# Altium schematic sheet 模拟触发器2.SchDoc
size A4
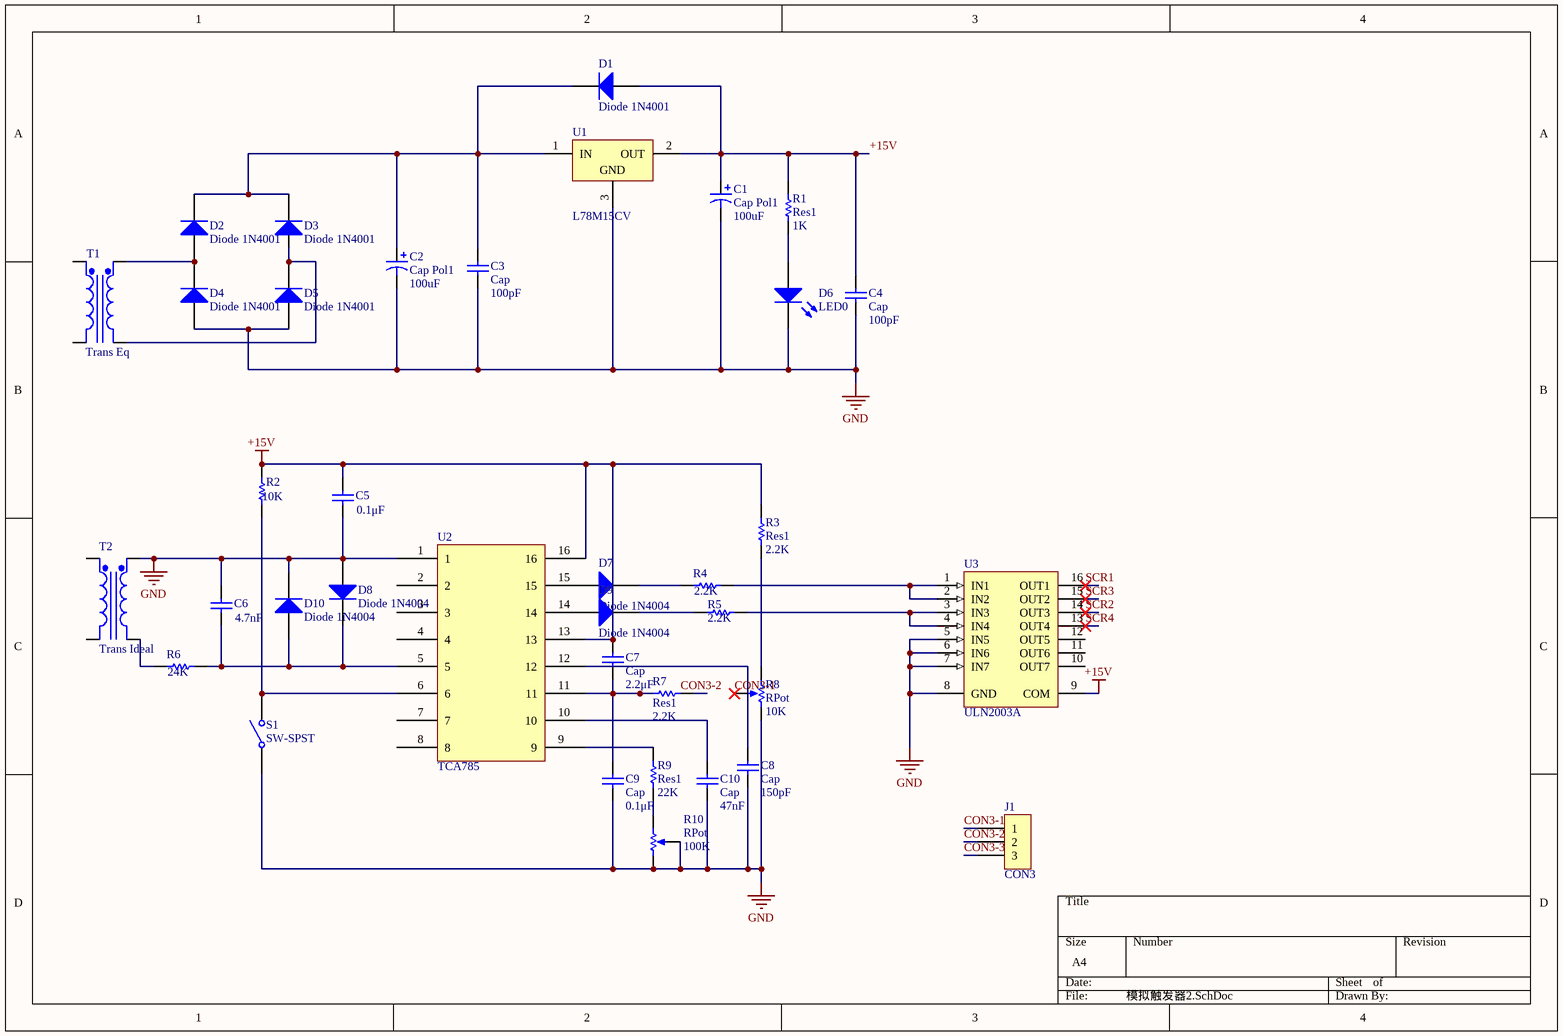
[diagram p0: 模拟触发器2.SchDoc]

## Parts
C1  Cap Pol1  value 100uF  [RB7.6-15]
C2  Cap Pol1  value 100uF  [RB7.6-15]
C3  Cap  value 100pF  [6-0805]
C4  Cap  value 100pF  [6-0805]
C5  value 0.1μF  [6-0805]  (hidden comment: Cap)
C6  value 4.7nF  [6-0805]  (hidden comment: Cap)
C7  Cap  value 2.2μF  [6-0805]
C8  Cap  value 150pF  [6-0805]
C9  Cap  value 0.1μF  [6-0805]
C10  Cap  value 47nF  [6-0805]
D1  Diode 1N4001  [DO-41]
D2  Diode 1N4001  [DO-41]
D3  Diode 1N4001  [DO-41]
D4  Diode 1N4001  [DO-41]
D5  Diode 1N4001  [DO-41]
D6  LED0  [6-0805]
D7  Diode 1N4004  [DO-41]
D8  Diode 1N4004  [DO-41]
D9  Diode 1N4004  [DO-41]
D10  Diode 1N4004  [DO-41]
J1  CON3  [DG1283-5.0]
R1  Res1  value 1K  [6-0805]
R2  value 10K  [6-0805]  (hidden comment: Res1)
R3  Res1  value 2.2K  [6-0805]
R4  value 2.2K  [6-0805]  (hidden comment: Res1)
R5  value 2.2K  [6-0805]  (hidden comment: Res1)
R6  value 24K  [1206]  (hidden comment: Res1)
R7  Res1  value 2.2K  [6-0805]
R8  RPot  value 10K  [VR5]
R9  Res1  value 22K  [6-0805]
R10  RPot  value 100K  [VR5]
S1  SW-SPST  [SPST-2]
T1  Trans Eq  [TRF_4]
T2  Trans Ideal  [TRF_4]
U1  L78M15CV  [TO220V]
U2  TCA785  [DIP-16]
U3  ULN2003A  [A16]

## Nets
+15V: C1.1 C4.2 C5.2 C7.2 D1.1(A) R1.2 R2.2 R3.2 U1.2(OUT) U2.13 U2.16 U3.9(COM)
GND: C1.2 C2.2 C3.1 C4.1 C5.1 C6.2 C8.1 C9.1 C10.1 D4.1(A) D5.1(A) D6.2(K) D8.1(A) D10.2(K) R8.2(BOT) R10.1(TOP) R10.3(TAP) S1.1(COMMON) T2.3(Sec+) U1.3(GND) U2.1 U3.5(IN5) U3.6(IN6) U3.7(IN7) U3.8(GND)
CON3-1: J1.1 R8.3(TAP)
CON3-2: J1.2
CON3-3: J1.3
SCR1: U3.16(OUT1)
SCR2: U3.14(OUT3)
SCR3: U3.15(OUT2)
SCR4: U3.13(OUT4)
NetC2_1: C2.1 C3.2 D1.2(K) D2.2(K) D3.2(K) U1.1(IN)
NetC6_1: C6.1 D8.2(K) D10.1(A) R6.1 U2.5
NetC7_1: C7.1 C9.2 R7.2 U2.11
NetC8_2: C8.2 U2.12
NetC10_2: C10.2 U2.10
NetD2_1: D2.1(A) D4.2(K) T1.3(Sec+)
NetD3_1: D3.1(A) D5.2(K) T1.4(Sec-)
NetD6_1: D6.1(A) R1.1
NetD7_2: D7.2(K) R4.2
NetD9_2: D9.2(K) R5.2
NetR2_1: R2.1 S1.2(NO) U2.6
NetR3_1: R3.1 R8.1(TOP)
NetR4_1: R4.1 U3.1(IN1) U3.2(IN2)
NetR5_1: R5.1 U3.3(IN3) U3.4(IN4)
NetR6_2: R6.2 T2.4(Sec-)
NetR9_1: R9.1 R10.2(BOT)
NetR9_2: R9.2 U2.9

Not connected (* = marked no-connect by the designer): D7 1(A); D9 1(A); R7 1; T1 1(Pri+) 2(Pri-); T2 1(Pri+) 2(Pri-); U2 2 3 4 7 8 14 15; U3 10(OUT7) 11(OUT6) 12(OUT5)

## Notes on the sheet
- Labels drawn without touching a wire or pin: CON3-2

## Library data of the parts
C1 C2 = Cap Pol1: Polarized Capacitor (Radial); Published: 8-Jun-2000; LatestRevisionDate: 17-Jul-2002; LatestRevisionNote: Re-released for DXP Platform.; PackageReference: RB7.6-15; Publisher: Altium Limited
C3-C10 = Cap: Capacitor; Published: 8-Jun-2000; LatestRevisionDate: 17-Jul-2002; LatestRevisionNote: Re-released for DXP Platform.; PackageReference: RAD-0.3; Publisher: Altium Limited
D1-D5 = Diode 1N4001: 1 Amp General Purpose Rectifier; Published: 8-Jun-2000; LatestRevisionDate: 17-Jul-2002; LatestRevisionNote: Re-released for DXP Platform.; DatasheetDocument: 1998; PackageDocument: Aug-1999; PackageReference: DO-41; Publisher: Altium Limited; Code_JEDEC: DO-204-AL; ComponentLink1Description: Manufacturer Link; ComponentLink1URL: http://www.fairchildsemi.com/; ComponentLink2Description: Datasheet; ComponentLink2URL: http://www.fairchildsemi.com/ds/1N%2F1N4001.pdf
D6 = LED0: Typical INFRARED GaAs LED; Published: 8-Jun-2000; LatestRevisionDate: 08-Jul-2005; LatestRevisionNote: Mech Layer 1 removed.; PackageReference: LED-0; Publisher: Altium Limited
D7-D10 = Diode 1N4004: 1 Amp General Purpose Rectifier; Published: 8-Jun-2000; LatestRevisionDate: 17-Jul-2002; LatestRevisionNote: Re-released for DXP Platform.; DatasheetDocument: 1998; PackageDocument: Aug-1999; PackageReference: DO-41; Publisher: Altium Limited; Code_JEDEC: DO-204-AL; ComponentLink1Description: Manufacturer Link; ComponentLink1URL: http://www.fairchildsemi.com/; ComponentLink2Description: Datasheet; ComponentLink2URL: http://www.fairchildsemi.com/ds/1N%2F1N4001.pdf
R1-R7 R9 = Res1: Resistor; Published: 8-Jun-2000; LatestRevisionDate: 17-Jul-2002; LatestRevisionNote: Re-released for DXP Platform.; PackageReference: AXIAL-0.3; Publisher: Altium Limited
R8 R10 = RPot: Potentiometer; Sim Note: Enter the Resistance value and the set point into parameter fields.; Set Position: 0.5; Published: 8-Jun-2000; LatestRevisionDate: 17-Jul-2002; LatestRevisionNote: Re-released for DXP Platform.; PackageReference: VR5; Publisher: Altium Limited
S1 = SW-SPST: Single-Pole, Single-Throw Switch; Published: 24-Mar-1999; LatestRevisionDate: 17-Jul-2002; LatestRevisionNote: Re-released for DXP Platform.; PackageReference: SPST-2; Publisher: Altium Limited
T1 = Trans Eq: Transformer (Equivalent Circuit Model); Published: 8-Jun-2000; LatestRevisionDate: 17-Jul-2002; LatestRevisionNote: Re-released for DXP Platform.; PackageReference: TRF_4; Publisher: Altium Limited
T2 = Trans Ideal: Transformer (Ideal); Published: 8-Jun-2000; LatestRevisionDate: 17-Jul-2002; LatestRevisionNote: Re-released for DXP Platform.; PackageReference: TRF_4; Publisher: Altium Limited
U1 = L78M15CV: Positive Voltage Regulator; Note: Tab is connected to pin 3 (GND).; Published: 24-Aug-2001; LatestRevisionDate: 17-Jul-2002; LatestRevisionNote: Re-released for DXP Platform.; DatasheetVersion: Apr-1994; PackageReference: TO220V; Publisher: Altium Limited; PackageDescription: TO, Thru-Hole, Vertical, Heatsink Mounted; 3 In-Line Leads; Pitch 2.54 mm; Pin sequence 1, 3, 2; ComponentLink1Description: Manufacturer Link; ComponentLink1URL: http://www.st.com/; ComponentLink2Description: Datasheet; ComponentLink2URL: http://www.st.com/stonline/products/literature/ds/2146/l78m05c.pdf
U3 = ULN2003A: High-Voltage, High-Current Darlington Array; Published: 13-Oct-2000; LatestRevisionDate: 06-Jun-2005; LatestRevisionNote: Stylized 3D Model Added.; DatasheetVersion: 1998; PackageVersion: 1998; PackageReference: A16; Publisher: Altium Limited; PackageDescription: DIP; 16 Leads; Row Spacing 7.62 mm; Pitch 2.54 mm; Code_JEDEC: MS-001-BB; ComponentLink1Description: Manufacturer Link; ComponentLink1URL: http://www.allegromicro.com/